# Altium schematic sheet [05] Optic sensor.SchDoc
size A4
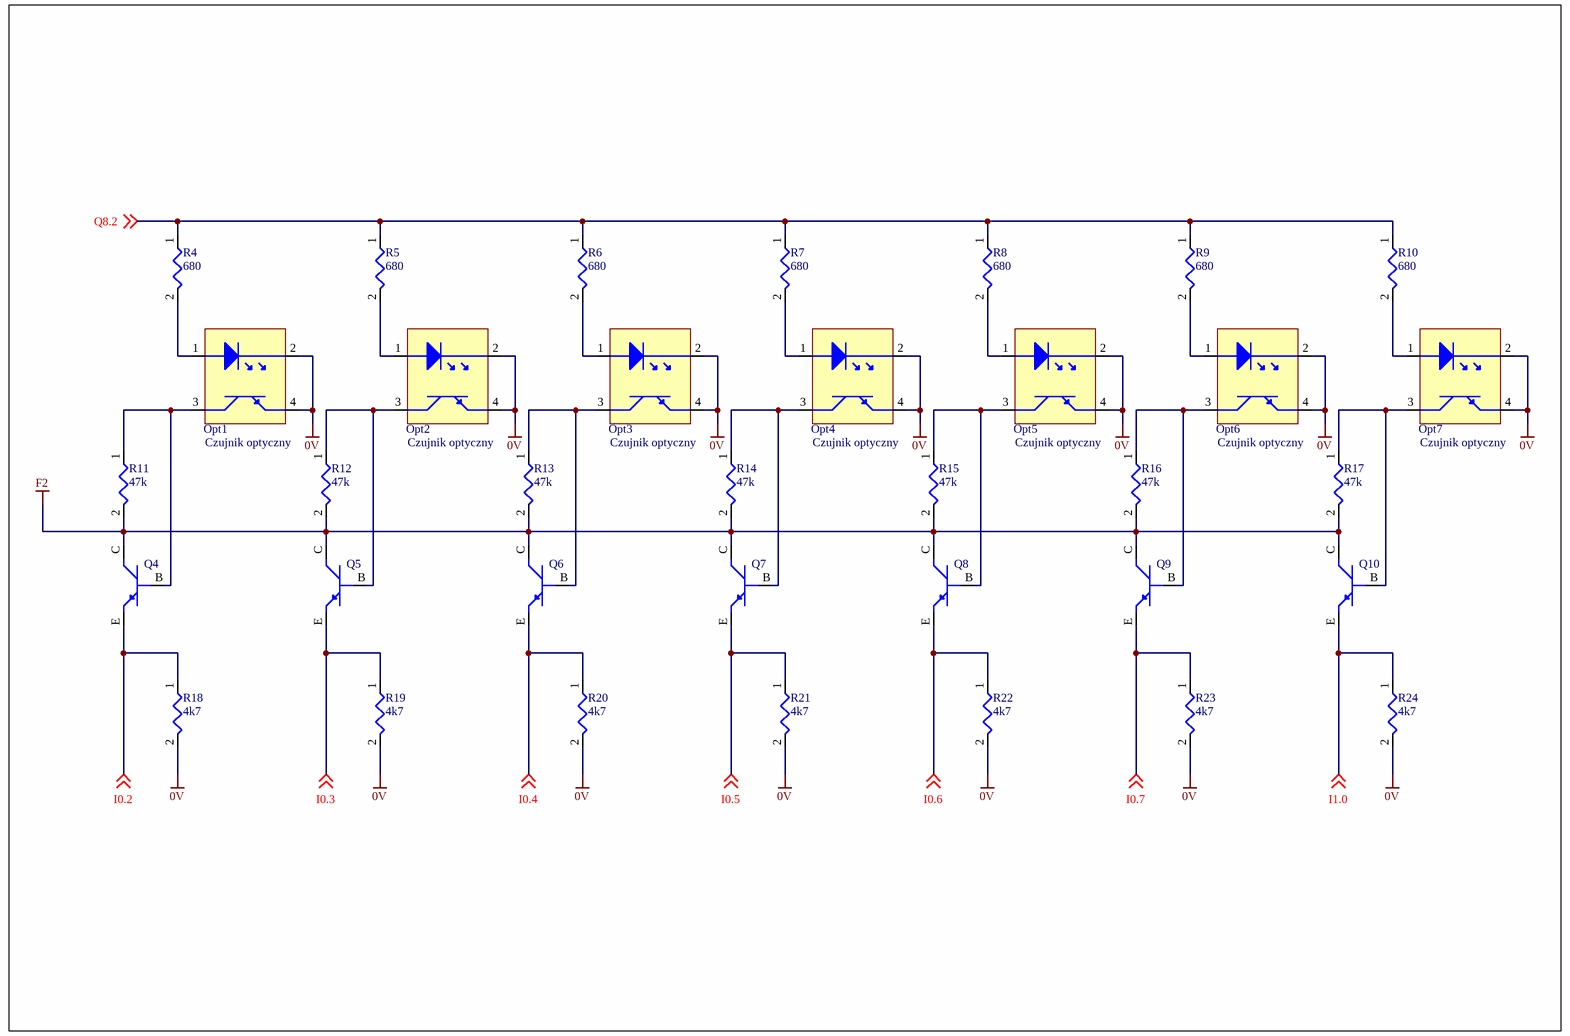
[diagram p0: [05] Optic sensor.SchDoc]

## Parts
Opt1  Czujnik optyczny
Opt2  Czujnik optyczny
Opt3  Czujnik optyczny
Opt4  Czujnik optyczny
Opt5  Czujnik optyczny
Opt6  Czujnik optyczny
Opt7  Czujnik optyczny
Q4  NPN  (value not drawn)
Q5  NPN  (value not drawn)
Q6  NPN  (value not drawn)
Q7  NPN  (value not drawn)
Q8  NPN  (value not drawn)
Q9  NPN  (value not drawn)
Q10  NPN  (value not drawn)
R4  680
R5  680
R6  680
R7  680
R8  680
R9  680
R10  680
R11  47k
R12  47k
R13  47k
R14  47k
R15  47k
R16  47k
R17  47k
R18  4k7
R19  4k7
R20  4k7
R21  4k7
R22  4k7
R23  4k7
R24  4k7

## Nets
0V: Opt1.2 Opt1.4 Opt2.2 Opt2.4 Opt3.2 Opt3.4 Opt4.2 Opt4.4 Opt5.2 Opt5.4 Opt6.2 Opt6.4 Opt7.2 Opt7.4 R18.2 R19.2 R20.2 R21.2 R22.2 R23.2 R24.2
F2: Q4.C Q5.C Q6.C Q7.C Q8.C Q9.C Q10.C R11.2 R12.2 R13.2 R14.2 R15.2 R16.2 R17.2
I0.2: Q4.E R18.1 ; off-sheet I0.2
I0.3: Q5.E R19.1 ; off-sheet I0.3
I0.4: Q6.E R20.1 ; off-sheet I0.4
I0.5: Q7.E R21.1 ; off-sheet I0.5
I0.6: Q8.E R22.1 ; off-sheet I0.6
I0.7: Q9.E R23.1 ; off-sheet I0.7
I1.0: Q10.E R24.1 ; off-sheet I1.0
Q8.2: R4.1 R5.1 R6.1 R7.1 R8.1 R9.1 R10.1 ; off-sheet Q8.2
NetOpt1_1: Opt1.1 R4.2
NetOpt1_3: Opt1.3 Q4.B R11.1
NetOpt2_1: Opt2.1 R5.2
NetOpt2_3: Opt2.3 Q5.B R12.1
NetOpt3_1: Opt3.1 R6.2
NetOpt3_3: Opt3.3 Q6.B R13.1
NetOpt4_1: Opt4.1 R7.2
NetOpt4_3: Opt4.3 Q7.B R14.1
NetOpt5_1: Opt5.1 R8.2
NetOpt5_3: Opt5.3 Q8.B R15.1
NetOpt6_1: Opt6.1 R9.2
NetOpt6_3: Opt6.3 Q9.B R16.1
NetOpt7_1: Opt7.1 R10.2
NetOpt7_3: Opt7.3 Q10.B R17.1

## Library data of the parts
Opt1-Opt7 = Optoisolator
Q4-Q10 = NPN Transistor
R4-R24 = Resistor